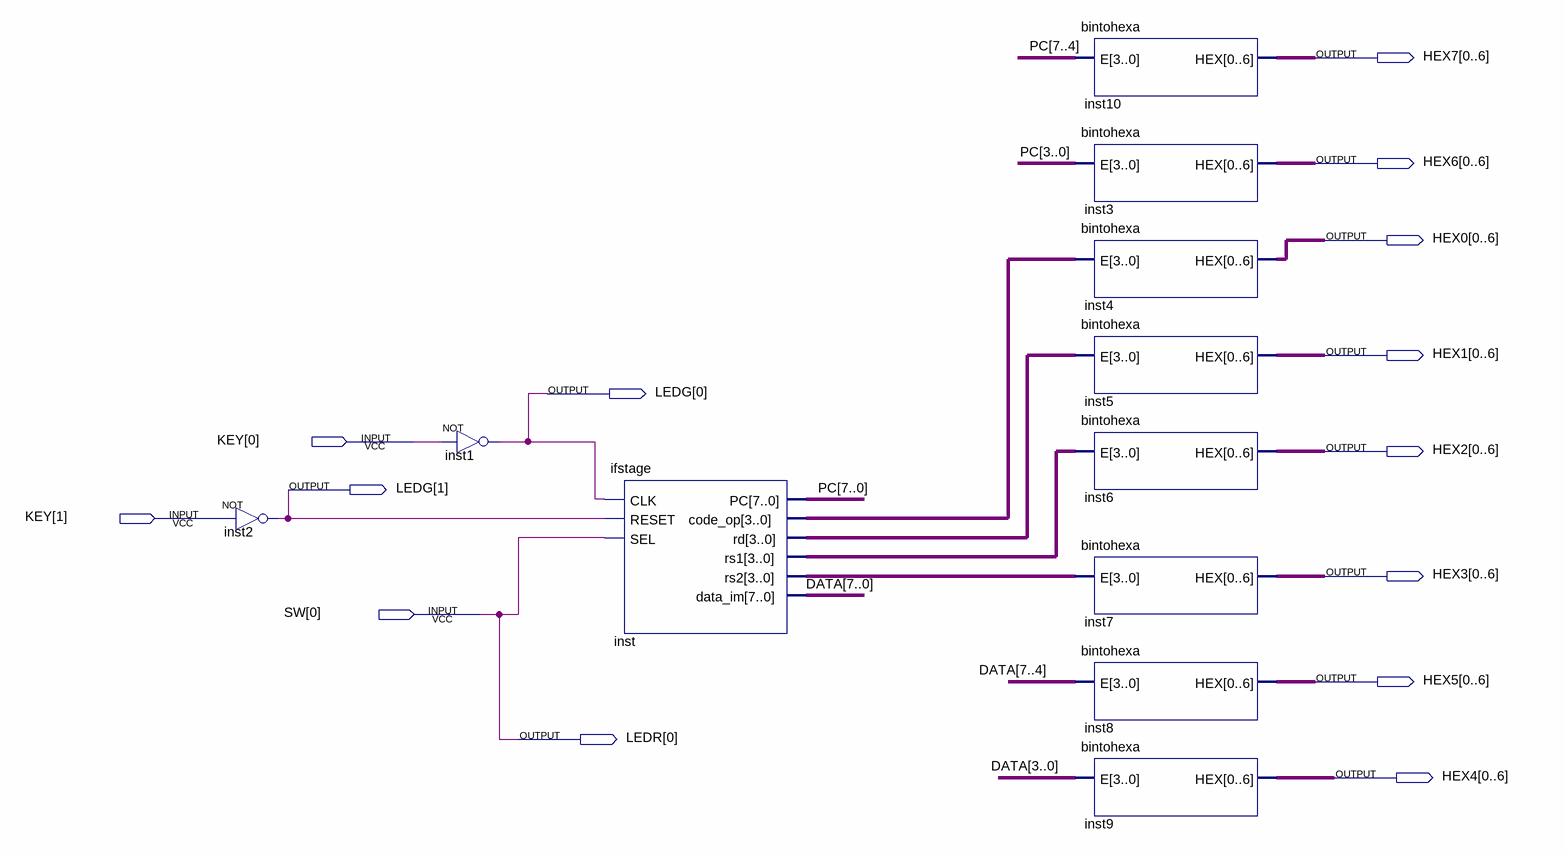
[diagram p0: schematic sheet]
// Quartus schematic test_stage.bdf as structural Verilog: 11 symbols, 14 pins
module test_stage (
  input  [1:0] KEY,
  input  [0:0] SW,
  output [0:6] HEX7,
  output [0:6] HEX6,
  output [0:6] HEX0,
  output [0:6] HEX1,
  output [1:0] LEDG,
  output [0:6] HEX2,
  output [0:6] HEX3,
  output [0:6] HEX5,
  output [0:0] LEDR,
  output [0:6] HEX4
);

  wire [3:0] inst_code_op, inst_rd, inst_rs1, inst_rs2;
  wire [7:0] DATA, PC;

  not inst2 (LEDG[1], KEY[1]);
  not inst1 (LEDG[0], KEY[0]);
  ifstage inst (
    .CLK(LEDG[0]), .RESET(LEDG[1]), .SEL(SW[0]), .PC(PC), .code_op(inst_code_op), .rd(inst_rd),
    .rs1(inst_rs1), .rs2(inst_rs2), .data_im(DATA));
  bintohexa inst10 (.E(PC[7:4]), .HEX(HEX7));
  bintohexa inst3 (.E(PC[3:0]), .HEX(HEX6));
  bintohexa inst4 (.E(inst_code_op), .HEX(HEX0));
  bintohexa inst5 (.E(inst_rd), .HEX(HEX1));
  bintohexa inst6 (.E(inst_rs1), .HEX(HEX2));
  bintohexa inst7 (.E(inst_rs2), .HEX(HEX3));
  bintohexa inst8 (.E(DATA[7:4]), .HEX(HEX5));
  bintohexa inst9 (.E(DATA[3:0]), .HEX(HEX4));

  assign LEDR[0] = SW[0];
endmodule
